# EAGLE design flash-pgm (EAGLE 8.2.2)
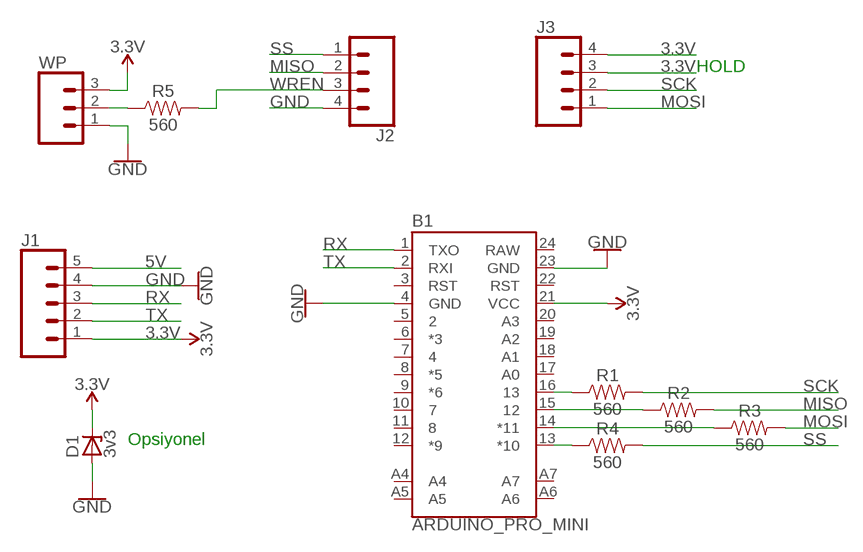
[diagram p0: schematic, sheet 1]

## Parts
B1  ARDUINO_PRO_MINI  [ARDUINO_PRO_MINI]
D1  3v3  ZENER-DIODEC1702-15  [C1702-15]
J1  CONN_05  [1X05]
J2  CONN_04  [1X04]
J3  CONN_04  [1X04]
R1  560  RESISTORAXIAL-0.3  [AXIAL-0.3]
R2  560  RESISTORAXIAL-0.3  [AXIAL-0.3]
R3  560  RESISTORAXIAL-0.3  [AXIAL-0.3]
R4  560  RESISTORAXIAL-0.3  [AXIAL-0.3]
R5  560  RESISTORAXIAL-0.3  [AXIAL-0.3]
WP  CONN_03  [1X03]

## Nets
3.3V: B1.21(VCC) D1.C J1.1 J3.3 J3.4 WP.3
5V: J1.5
GND: B1.4(GND) B1.23(GND) D1.A J1.4 J2.4 WP.1
MISO: J2.2 R2.P$2
MOSI: J3.1 R3.P$2
N$1: B1.16 R1.P$1
N$2: R5.P$1 WP.2
N$3: B1.15 R2.P$1
N$5: B1.14(*11) R3.P$1
N$7: B1.13(*10) R4.P$1
RX: B1.1(TXO) J1.3
SCK: J3.2 R1.P$2
SS: J2.1 R4.P$2
TX: B1.2(RXI) J1.2
WREN: J2.3 R5.P$2
Unconnected: B1.3(RST) B1.5 B1.6(*3) B1.7 B1.8(*5) B1.9(*6) B1.10 B1.11 B1.12(*9) B1.17(A0) B1.18(A1) B1.19(A2) B1.20(A3) B1.22(RST) B1.A4 B1.A5 B1.A6 B1.A7

## Notes on the sheet
- HOLD
- Opsiyonel

## Power pins joined to a net without a drawn wire
RAW: B1.24(RAW)

## Library data of the parts
B1 = SparkFun-Boards:ARDUINO_PRO_MINI: SparkFun Pro Mini Pro Mini compatible footprint. Dimensions: 0.7 x 1.3" PCB Thickness: 0.8mm SparkFun Products: 3.3V/8MHz <https://www.sparkfun.com/products/11114> 5V/16MHz <https://www.sparkfun.com/products/11113>
D1 = diode:ZENER-DIODE: Z-Diode
J1 = SparkFun-Connectors:CONN_05: Multi connection point. Often used as Generic Header-pin footprint for 0.1 inch spaced/style header connections On any of the 0.1 inch spaced packages, you can populate with these: Break Away Headers - Straight <https://www.sparkfun.com/products/116> (PRT-00116) Break Away Male Headers - Right Angle <https://www.sparkfun.com/products/553> (PRT-00553) Female Headers <https://www.sparkfun.com/products/115> (PRT-00115) Break Away Headers - Machine Pin <https://www.sparkfun.com/products/117> (PRT-00117) Break Away Female Headers - Swiss Machine Pin <https://www.sparkfun.com/products/743> (PRT-00743) For SCREWTERMINALS and SPRING TERMINALS visit here: Screw Terimnals on SparkFun.com <https://www.sparkfun.com/search/results?term=Screw+Terminals> (5mm/3.5mm/2.54mm spacing) This device is also useful as a general connection point to wire up your design to another part of your project. Our various solder wires solder well into these plated through hole pads. Hook-Up Wire - Assortment (Stranded, 22 AWG) <https://www.sparkfun.com/products/11375> (PRT-11375) Hook-Up Wire - Assortment (Solid Core, 22 AWG) <https://www.sparkfun.com/products/11367> (PRT-11367) View the entire wire category on our website here <https://www.sparkfun.com/categories/141> Special notes: Molex polarized connector foot print use with SKU : PRT-08231 with associated crimp pins and housings. 1MM SMD Version SKU: PRT-10208
J2 J3 = SparkFun-Connectors:CONN_04: Multi connection point. Often used as Generic Header-pin footprint for 0.1 inch spaced/style header connections On any of the 0.1 inch spaced packages, you can populate with these: Break Away Headers - Straight <https://www.sparkfun.com/products/116> (PRT-00116) Break Away Male Headers - Right Angle <https://www.sparkfun.com/products/553> (PRT-00553) Female Headers <https://www.sparkfun.com/products/115> (PRT-00115) Break Away Headers - Machine Pin <https://www.sparkfun.com/products/117> (PRT-00117) Break Away Female Headers - Swiss Machine Pin <https://www.sparkfun.com/products/743> (PRT-00743) For SCREWTERMINALS and SPRING TERMINALS visit here: Screw Terimnals on SparkFun.com <https://www.sparkfun.com/search/results?term=Screw+Terminals> (5mm/3.5mm/2.54mm spacing) This device is also useful as a general connection point to wire up your design to another part of your project. Our various solder wires solder well into these plated through hole pads. Hook-Up Wire - Assortment (Stranded, 22 AWG) <https://www.sparkfun.com/products/11375> (PRT-11375) Hook-Up Wire - Assortment (Solid Core, 22 AWG) <https://www.sparkfun.com/products/11367> (PRT-11367) View the entire wire category on our website here <https://www.sparkfun.com/categories/141> Special notes: Molex polarized connector foot print use with SKU : PRT-08231 with associated crimp pins and housings. 1MM SMD Version SKU: PRT-10208; PROD_ID: CONN-09696
R1-R5 = SparkFun-Resistors:RESISTOR: Generic Resistor Package
WP = SparkFun-Connectors:CONN_03: Multi connection point. Often used as Generic Header-pin footprint for 0.1 inch spaced/style header connections On any of the 0.1 inch spaced packages, you can populate with these: Break Away Headers - Straight <https://www.sparkfun.com/products/116> (PRT-00116) Break Away Male Headers - Right Angle <https://www.sparkfun.com/products/553> (PRT-00553) Female Headers <https://www.sparkfun.com/products/115> (PRT-00115) Break Away Headers - Machine Pin <https://www.sparkfun.com/products/117> (PRT-00117) Break Away Female Headers - Swiss Machine Pin <https://www.sparkfun.com/products/743> (PRT-00743) Stackable Header - 3 Pin (Female, 0.1") <https://www.sparkfun.com/products/13875> (PRT-13875) For SCREWTERMINALS and SPRING TERMINALS visit here: Screw Terimnals on SparkFun.com <https://www.sparkfun.com/search/results?term=Screw+Terminals> (5mm/3.5mm/2.54mm spacing) This device is also useful as a general connection point to wire up your design to another part of your project. Our various solder wires solder well into these plated through hole pads. Hook-Up Wire - Assortment (Stranded, 22 AWG) <https://www.sparkfun.com/products/11375> (PRT-11375) Hook-Up Wire - Assortment (Solid Core, 22 AWG) <https://www.sparkfun.com/products/11367> (PRT-11367) View the entire wire category on our website here <https://www.sparkfun.com/categories/141> Special notes: Molex polarized connector foot print use with SKU : PRT-08232 with associated crimp pins and housings.

## Board
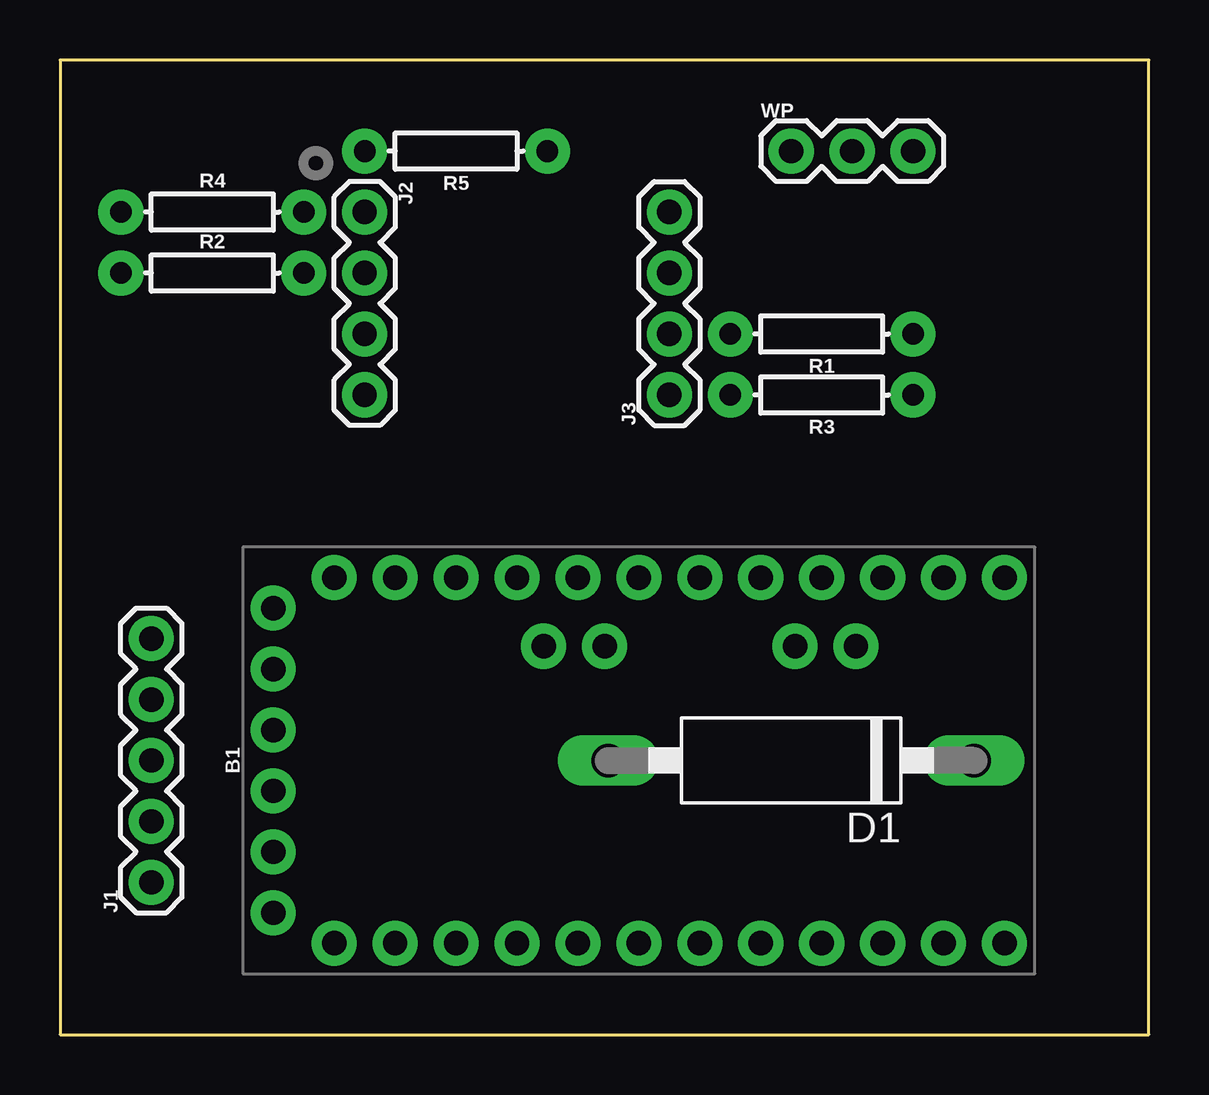
[diagram p1: board, top side]
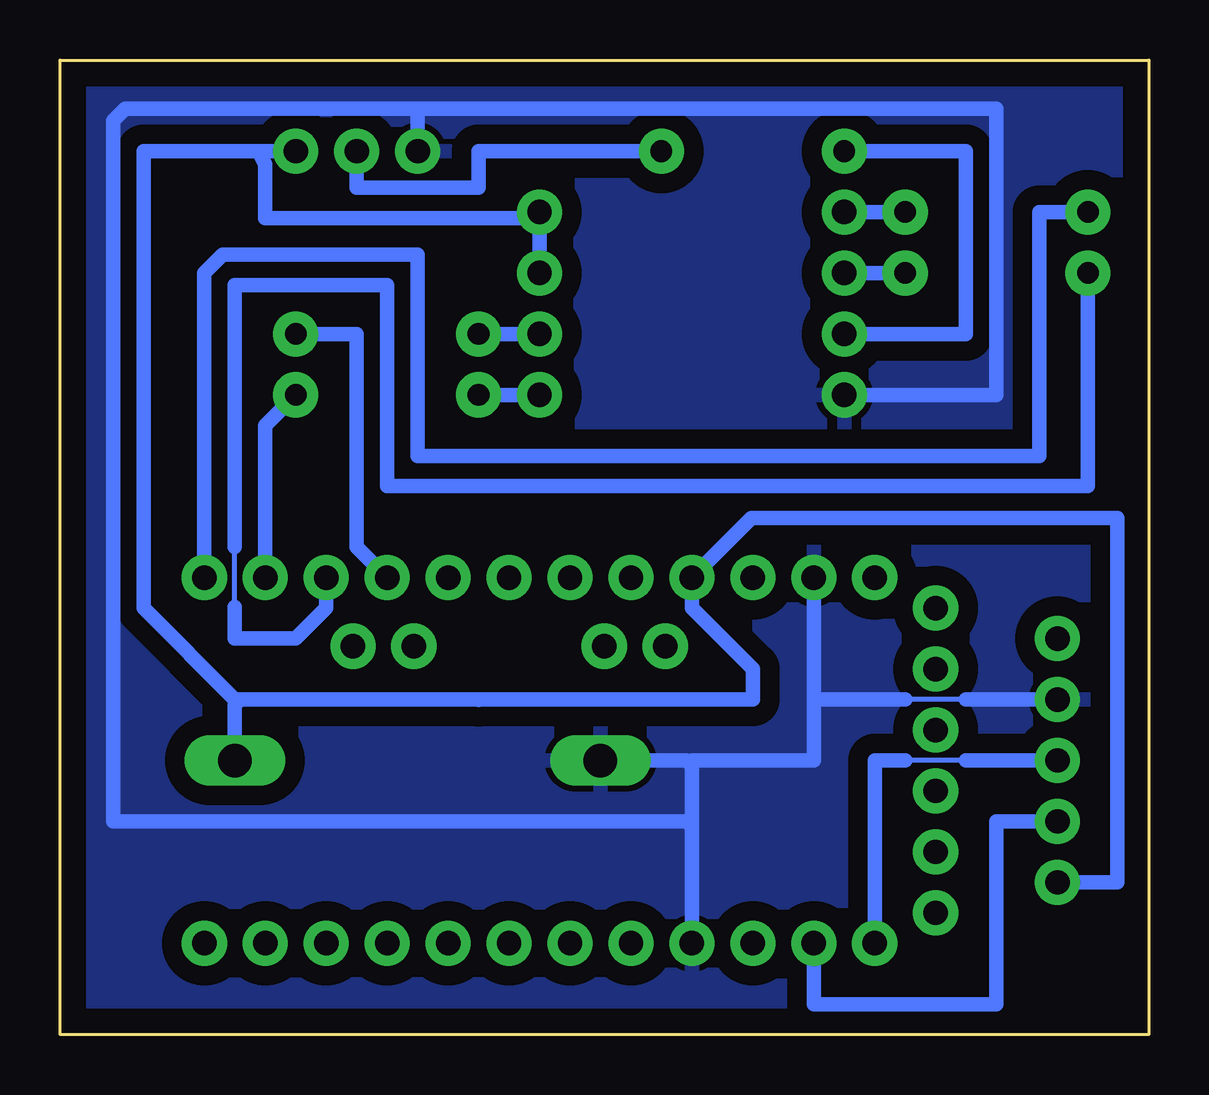
[diagram p2: board, bottom side, seen from below]

Size 45.39 x 40.63 mm. Coordinates in mm from the lower left corner, seen from the top.
Outline: 0,0 45.39,0 45.39,40.63 0,40.63 0,0
Copper layers (1*16): Top 0.035mm / dielectric 1.5mm / Bottom 0.035mm
Design rules "default": minimum track width 6mil, minimum drill 0.35mm, track to track 6mil, track to pad 6mil, pad to pad 6mil, via to via 6mil, smd to smd 6mil, copper to edge 40mil, drill to drill 6mil, minimum pad ring 10mil, minimum via ring 8mil, stop-mask expansion 4mil, vias tented up to drill 0mil, thermal gap 10mil

### Footprints (pad centres in the part's own frame; a part is rotated, then mirrored left to right if it is on the bottom)
ARDUINO_PRO_MINI = drill 1.016 pad 1.88: 1 -7.62,12.7; 2 -7.62,10.16; 3 -7.62,7.62; 4 -7.62,5.08; 5 -7.62,2.54; 6 -7.62,0; 7 -7.62,-2.54; 8 -7.62,-5.08; 9 -7.62,-7.62; 10 -7.62,-10.16; 11 -7.62,-12.7; 12 -7.62,-15.24; 13 7.62,-15.24; 14 7.62,-12.7; 15 7.62,-10.16; 16 7.62,-7.62; 17 7.62,-5.08; 18 7.62,-2.54; 19 7.62,0; 20 7.62,2.54; 21 7.62,5.08; 22 7.62,7.62; 23 7.62,10.16; 24 7.62,12.7; A4 4.763,1.429; A5 4.763,3.969; A6 4.763,-9.049; A7 4.763,-6.509; BLK -6.35,15.24; GND -3.81,15.24; GRN 6.35,15.24; RXI 1.27,15.24; TXO 3.81,15.24; VCC -1.27,15.24
C1702-15 = drill 1.397 long: A 7.62,0; C -7.62,0
1X05 = drill 1.016 pad 1.88: 1 0,0; 2 2.54,0; 3 5.08,0; 4 7.62,0; 5 10.16,0
1X04 = drill 1.016 pad 1.88: 1 0,0; 2 2.54,0; 3 5.08,0; 4 7.62,0
AXIAL-0.3 = drill 0.9 pad 1.88: P$1 -3.81,0; P$2 3.81,0
1X03 = drill 1.016 pad 1.88: 1 0,0; 2 2.54,0; 3 5.08,0

### Placement (x,y rotation side)
B1  24.13,11.43 90 top
D1  30.48,11.43 180 top
J1  3.81,6.35 90 top
J2  12.7,34.29 270 top
J3  25.4,26.67 90 top
R1  31.75,29.21 180 top
R2  6.35,31.75 0 top
R3  31.75,26.67 180 top
R4  6.35,34.29 0 top
R5  16.51,36.83 180 top
WP  30.48,36.83 0 top

### Tracks (layer width: path | path; a pad name or v marks a point on that pad's centre or on a via)
3.3V
  Bottom 0.61: J1.1 1.32,6.35 1.32,21.54 16.56,21.54 B1.21 19.05,17.78 16.51,15.24 16.51,13.97 27.93,13.97 | 37.88,13.97 27.93,13.97 | 37.88,13.97 38.1,13.97 41.91,17.78 41.91,36.83 37.1,36.83 | 25.4,34.04 36.83,34.04 36.83,36.28 37.1,36.83 | 25.4,34.04 J3.3 | J3.4 25.4,34.04 | 37.1,36.83 WP.3 | 27.94,13.96 27.93,13.97 | D1.C 38.1,13.75 37.88,13.97
GND
  Bottom 0.203: 7.62,13.97 10.16,13.97
  Bottom 0.61: J1.4 7.62,13.97 | 10.16,13.97 13.97,13.97 | 13.97,13.97 B1.23 | 30.6,38.61 42.67,38.61 43.18,38.1 43.18,8.89 19.27,8.89 19.05,8.66 | 30.6,38.61 6.35,38.61 6.35,26.67 J2.4 | 13.97,13.97 13.97,11.43 19.05,11.43 19.05,11.21 | 19.05,11.21 19.05,8.66 | 19.05,8.66 B1.4 | WP.1 30.48,38.49 30.6,38.61 | D1.A 19.27,11.43 19.05,11.21
  pour Bottom (isolate 0.813): 0,40.64 0,0 45.72,0 45.72,40.64
MISO
  Bottom 0.61: R2.P$2 J2.2
MOSI
  Bottom 0.61: R3.P$2 J3.1
N$1
  Bottom 0.61: B1.16 33.02,20.32 33.02,29.21 R1.P$1
N$2
  Bottom 0.61: R5.P$1 27.94,36.83 27.94,35.31 33.02,35.31 WP.2
N$3
  Bottom 0.203: 38.1,20.32 38.1,17.83 38.1,17.78
  Bottom 0.61: R2.P$1 2.54,22.86 31.75,22.86 31.75,31.24 38.1,31.24 38.1,20.32 | B1.15 34.29,17.78 35.56,16.51 38.1,16.51 38.1,17.83
N$5
  Bottom 0.61: R3.P$1 36.83,25.4 B1.14
N$7
  Bottom 0.61: R4.P$1 4.57,34.29 4.57,24.13 30.48,24.13 30.48,32.51 38.61,32.51 39.37,31.75 B1.13
RX
  Bottom 0.203: 7.62,11.43 10.16,11.43
  Bottom 0.61: J1.3 7.62,11.43 | 10.16,11.43 11.43,11.43 B1.1
SCK
  Bottom 0.61: R1.P$2 J3.2
SS
  Bottom 0.61: R4.P$2 J2.1
TX
  Bottom 0.61: J1.2 6.35,8.89 6.35,1.27 13.97,1.27 B1.2
WREN
  Bottom 0.61: J2.3 7.62,29.21 7.62,36.83 R5.P$2

### Text on the board
tDocu: Write protect: / ON OFF | 1 / 2 / 3 / 4 | 8 / 7 / 6 / 5 | SPI Flash Programmer / Use with 3.3v ttl adapter
bDocu: NC / GND / RX / TX / 3.3V